# Altium schematic sheet USB_Com.SchDoc
size A4; SheetNumber: 5; SheetTotal: 7
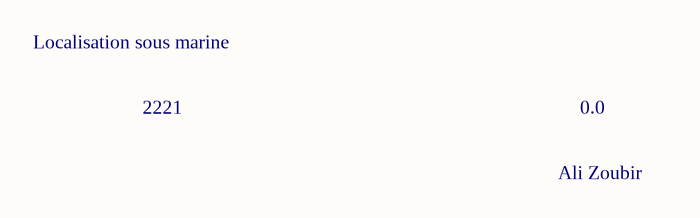
[diagram p0: USB_Com.SchDoc]

## Notes on the sheet
- Localisation sous marine
- 2221
- 0.0
- Ali Zoubir